# EAGLE schematic MB_Nano_V6s (EAGLE 9.5.0)
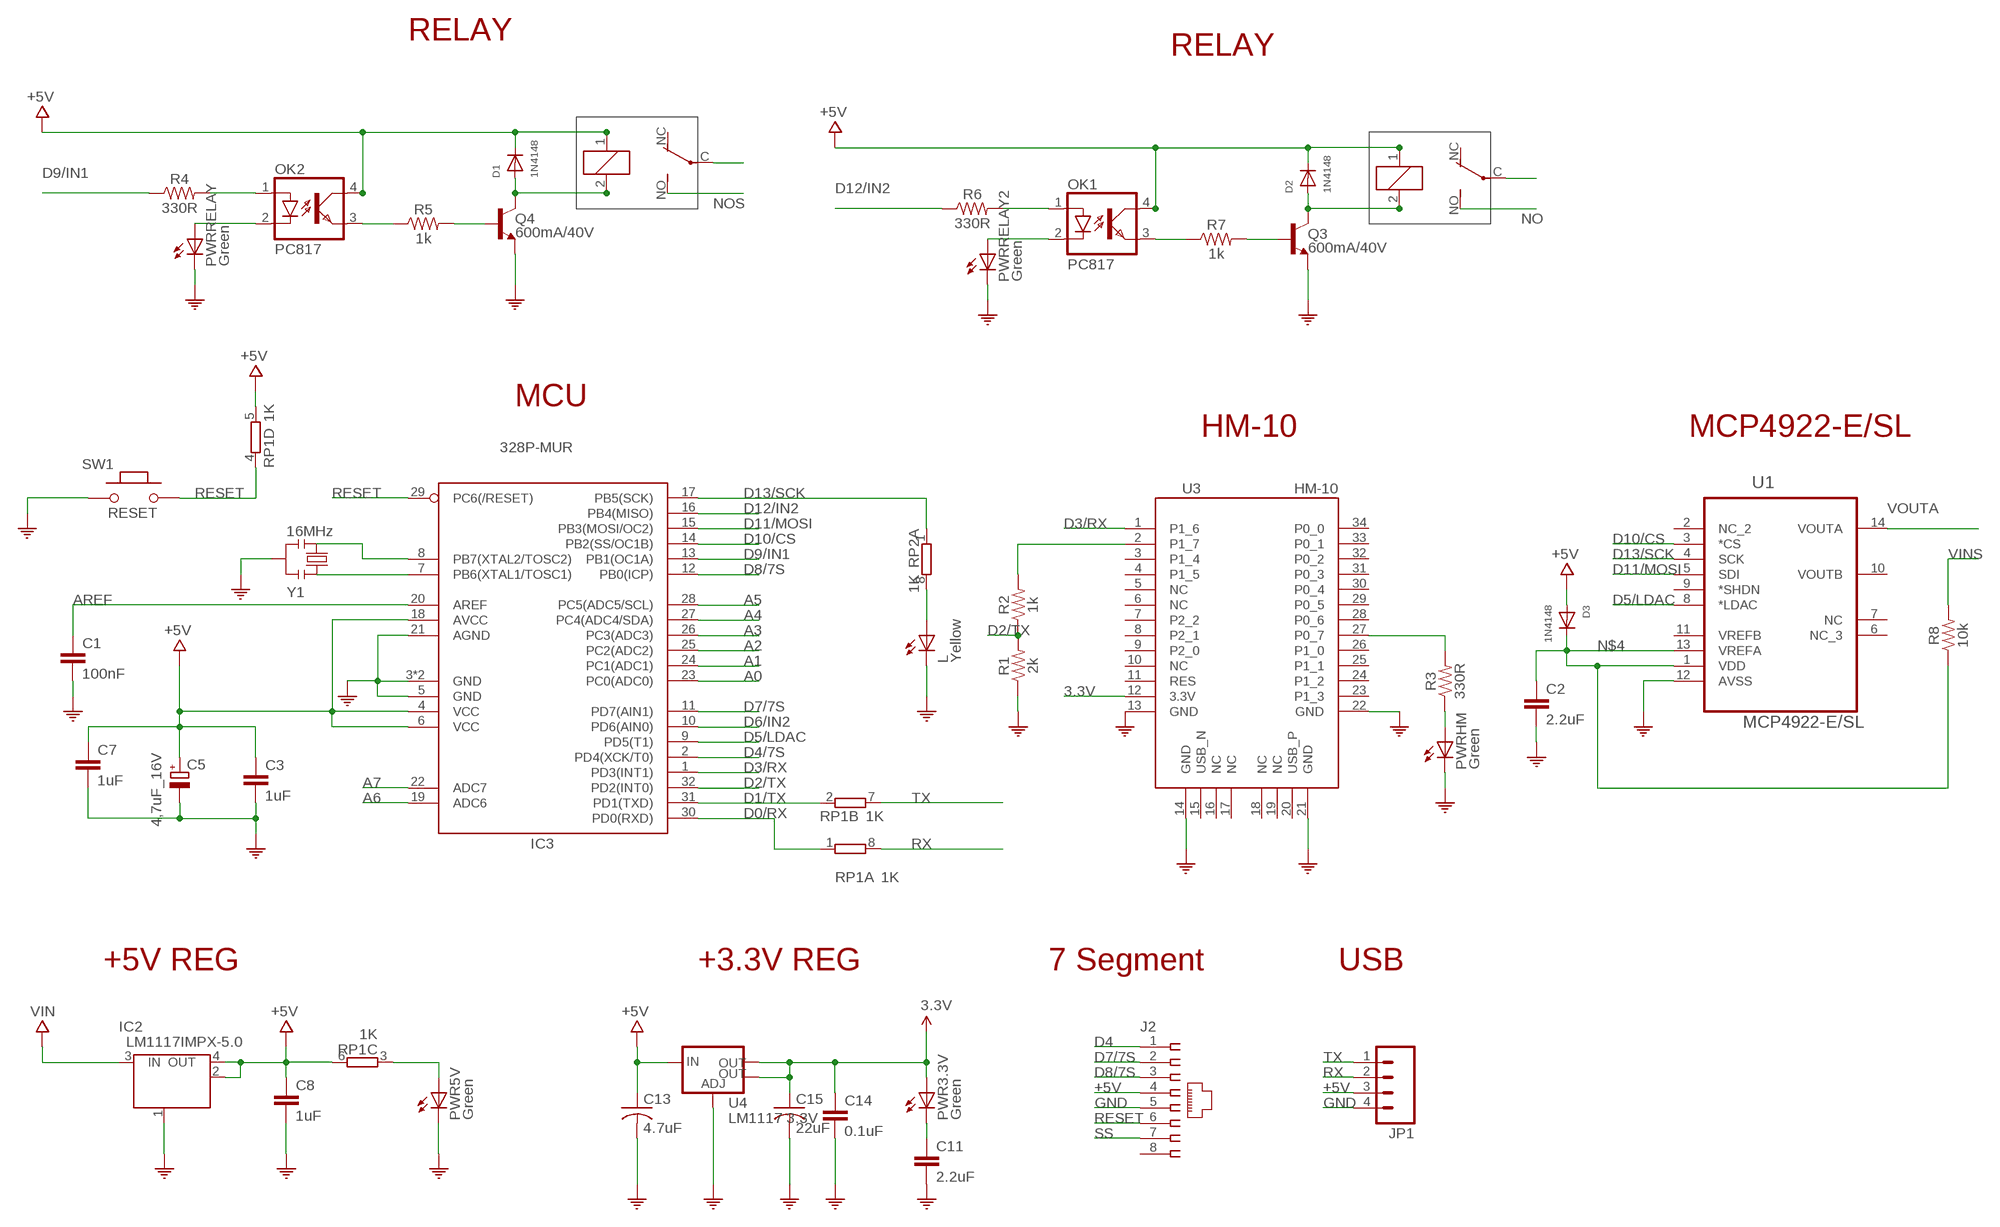
[diagram p0: schematic, sheet 1]

## Parts
C1  100nF  0015_100NF_0603  [C0603-ROUND]
C2  2.2uF  0006_1UF_0603/GRM188R61E105KA12D  [C0603-ROUND]
C3  1uF  0006_1UF_0603/GRM188R61E105KA12D  [C0603-ROUND]
C5  4,7uF_16V  0833_TAJA475MO16RNJ  [TAN-A]
C7  1uF  0006_1UF_0603/GRM188R61E105KA12D  [C0603-ROUND]
C8  1uF  0006_1UF_0603/GRM188R61E105KA12D  [C0603-ROUND]
C11  2.2uF  0006_1UF_0603/GRM188R61E105KA12D  [C0603-ROUND]
C13  4.7uF  C-USC1206  [C1206]
C14  0.1uF  CAP0805  [0805]
C15  22uF  C-USC1206  [C1206]
D1  1N4148  DIODESOD-523  [SOD-523]
D2  1N4148  DIODESOD-523  [SOD-523]
D3  1N4148  DIODESOD-523  [SOD-523]
IC2  LM1117IMPX-5.0  0022_LM1117IMPX-5.0  [LINEAR_SOT223]
IC3  328P-MUR  ATMEGA328P-32MUR  [VQFN32]
J2  520259-4  [520259-4]
JP1  M04POLAR_LOCK  [MOLEX-1X4_LOCK]
L  Yellow  0044_KPT-2012YC  [CHIPLED_0805]
OK1  PC817  [DIL04]
OK2  PC817  [DIL04]
PWR3.3V  Green  0043_KPT-2012SGC  [CHIPLED_0805]
PWR5V  Green  0043_KPT-2012SGC  [CHIPLED_0805]
PWRHM  Green  0043_KPT-2012SGC  [CHIPLED_0805]
PWRRELAY  Green  0043_KPT-2012SGC  [CHIPLED_0805]
PWRRELAY2  Green  0043_KPT-2012SGC  [CHIPLED_0805]
Q3  600mA/40V  TRANS_NPN-MMBT2222AL  [SOT23-3]
Q4  600mA/40V  TRANS_NPN-MMBT2222AL  [SOT23-3]
R1  2k  33OHM-0603-1/10W-1%  [0603]
R2  1k  33OHM-0603-1/10W-1%  [0603]
R3  330R  33OHM-0603-1/10W-1%  [0603]
R4  330R  33OHM-0603-1/10W-1%  [0603]
R5  1k  1KOHM-0603-1/10W-1%  [0603]
R6  330R  33OHM-0603-1/10W-1%  [0603]
R7  1k  1KOHM-0603-1/10W-1%  [0603]
R8  10k  1KOHM-0603-1/10W-1%  [0603]
RELAY5VDC  RELAY 5VDC  CQ1-12V  [CQ1]
RELAY5VDC1  RELAY 5VDC  CQ1-12V  [CQ1]
RP1  1K  0005_064R_1K_/_CAY16-102J4LF  [CAY16]
RP2  1K  0005_064R_1K_/_CAY16-102J4LF  [CAY16]
SW1  RESET  0173_IT-1185AP1C-160G-G_T&R  [SMD_157SW]
U1  MCP4922-E/SL  [SOIC127P600X175-14N]
U3  HM-10  [HM-10]
U4  LM1117 3.3V  V_REG_LM1117SOT223  [SOT223]
Y1  16MHz  0011_CSTCE16M0V53-R0  [RESONATOR]

## Nets
3.3V [power]: C14.1 C15.1 PWR3.3V.A U3.12(3.3V) U4.2(OUT) U4.4(OUT)
3.3V1 [power]: PWRHM.A R3.1
22: D1.A Q4.3(C) RELAY5VDC1.2
+5V: C3.1 C5.1(+) C7.1 C8.1 C13.1 D1.K(C) D2.K(C) D3.A IC2.2(OUT) IC2.4(OUT) IC3.4(VCC) IC3.6(VCC) IC3.18(AVCC) J2.4 JP1.3 OK1.4(COL) OK2.4(COL) RELAY5VDC1.1 RELAY5VDC.1 RP1.5 RP1.6 U4.3(IN)
A0: IC3.23(PC0(ADC0))
A1: IC3.24(PC1(ADC1))
A2: IC3.25(PC2(ADC2))
A3: IC3.26(PC3(ADC3))
A4: IC3.27(PC4(ADC4/SDA))
A5: IC3.28(PC5(ADC5/SCL))
A6: IC3.19(ADC6)
A7: IC3.22(ADC7)
AREF: C1.1 IC3.20(AREF)
COM: C1.2 C2.2 C3.2 C5.2(-) C7.2 C8.2 C11.2 C13.2 C14.2 C15.2 IC2.1(GND/ADJ) IC3.3(GND) IC3.5(GND) IC3.21(AGND) IC3.33(GND) L.C PWR5V.C PWRHM.C PWRRELAY2.C PWRRELAY.C Q3.2(E) Q4.2(E) R1.1 SW1.1 U1.12(AVSS) U3.13(GND) U3.14(GND) U3.21(GND) U3.22(GND) U4.1(ADJ) Y1.2
D0/RX: IC3.30(PD0(RXD)) RP1.1
D1/TX: IC3.31(PD1(TXD)) RP1.2
D2/TX: IC3.32(PD2(INT0)) R1.2 R2.1
D3/RX: IC3.1(PD3(INT1)) U3.1(P1_6)
D4: J2.1
D4/7S: IC3.2(PD4(XCK/T0))
D5/LDAC: IC3.9(PD5(T1)) U1.8(*LDAC)
D6/IN2: IC3.10(PD6(AIN0))
D7/7S: IC3.11(PD7(AIN1)) J2.2
D8/7S: IC3.12(PB0(ICP)) J2.3
D9/IN1: IC3.13(PB1(OC1A)) R4.1
D10/CS: IC3.14(PB2(SS/OC1B)) U1.3(*CS)
D11/MOSI: IC3.15(PB3(MOSI/OC2)) U1.5(SDI)
D12/IN2: IC3.16(PB4(MISO)) R6.1
D13/SCK: IC3.17(PB5(SCK)) RP2.1 U1.4(SCK)
GND: J2.5 JP1.4
GND-: D2.A Q3.3(C) RELAY5VDC.2
INS: OK1.1(A) R6.2
INSS: OK2.1(A) R4.2
LED: OK1.2(C) PWRRELAY2.A
LEDS: OK2.2(C) PWRRELAY.A
N$1: IC3.8(PB7(XTAL2/TOSC2)) Y1.3
N$2: IC3.7(PB6(XTAL1/TOSC1)) Y1.1
N$3: PWR5V.A RP1.3
N$4 [power]: C2.1 C11.1 D3.K(C) PWR3.3V.C R8.1 U1.1(VDD) U1.13(VREFA)
N$5: R3.2 U3.27(P0_7)
N$7: L.A RP2.8
N$8: R2.2 U3.2(P1_7)
N$12: Q3.1(B) R7.2
N$20: Q4.1(B) R5.2
N$22: OK2.3(EMIT) R5.1
NO: RELAY5VDC.NO(2:S)
NOS: RELAY5VDC1.NO(2:S)
OTP: OK1.3(EMIT) R7.1
RESET: IC3.29(PC6(/RESET)) J2.6 RP1.4 SW1.2
RGND: RELAY5VDC.C(2:P)
RGNDS: RELAY5VDC1.C(2:P)
RX: JP1.2 RP1.8
SS: J2.7
TX: JP1.1 RP1.7
VIN: IC2.3(IN)
VINS: R8.2
VOUTA: U1.14(VOUTA)
Unconnected: J2.8 RELAY5VDC1.NC(2:O) RELAY5VDC.NC(2:O) RP2.2 RP2.3 RP2.4 RP2.5 RP2.6 RP2.7 U1.2(NC_2) U1.6(NC_3) U1.7(NC) U1.9(*SHDN) U1.10(VOUTB) U1.11(VREFB) U3.3(P1_4) U3.4(P1_5) U3.5(NC) U3.6(NC) U3.7(P2_2) U3.8(P2_1) U3.9(P2_0) U3.10(NC) U3.11(RES) U3.15(USB_N) U3.16(NC) U3.17(NC) U3.18(NC) U3.19(NC) U3.20(USB_P) U3.23(P1_3) U3.24(P1_2) U3.25(P1_1) U3.26(P1_0) U3.28(P0_6) U3.29(P0_5) U3.30(P0_4) U3.31(P0_3) U3.32(P0_2) U3.33(P0_1) U3.34(P0_0)

## Notes on the sheet
- RELAY
- RELAY
- MCU
- HM-10 | MCP4922-E/SL
- +5V REG | +3.3V REG | 7 Segment | USB

## Library data of the parts
C1 = Condensatori:0015_100NF_0603: 100nF 0603 50V; CASE: 0603; MONTHLY_USAGE: _____; PART_NUMBER: cl10b104kbnc; PRICE: _____; SUPPLIER: _____; TYPE: Condensatori
C2 C11 = Condensatori:0006_1UF_0603/GRM188R61E105KA12D: 1uF 0603; CASE: 0603; MONTHLY_USAGE: _____; PART_NUMBER: 1uF_0603/GRM188R61E105KA12D; PRICE: _____; SUPPLIER: _____; TYPE: Condensatori; VALUE: 1uF
C3 C7 C8 = Condensatori:0006_1UF_0603/GRM188R61E105KA12D: 1uF 0603; CASE: 0603; MONTHLY_USAGE: _____; PART_NUMBER: 1uF_0603/GRM188R61E105KA12D; PRICE: _____; SUPPLIER: _____; TYPE: Condensatori
C5 = Condensatori:0833_TAJA475MO16RNJ: 4,7uF; CASE: Case_A_(1206); MONTHLY_USAGE: _____; PART_NUMBER: TAJA475MO16RNJ; PRICE: _____; SUPPLIER: _____; TYPE: Condensatori
C13 C15 = adafruit:C-US: CAPACITOR, American symbol
C14 = SparkFun-Passives:CAP: Capacitor Standard 0603 ceramic capacitor, and 0.1" leaded capacitor.
D1-D3 = adafruit:DIODE: Diode SMADIODE - SMA Surface Mount Package 20V 1A Schottky Diode Digikey: 641-1014-6-ND DO-1N4148 - Through Hole Small Current Diode SOD-123 20V 1 A (.5mV Vf) Schottky Diode - Digikey: MBRX120TPMSCT-ND SOD-323 10V 570mA (.38mV Vf, 3ns) Schottky Diode - Digikey: ZLLS410CT-ND SOD-523 30V 30mA Schottky Diode (RB751S-40TE61) - Digikey: RB751S-40TE61CT-ND SOT23-R/W - SOT23 Package (R = Solder Paste/Reflow Ovens, W = Hand-Soldering) BAT54Film 40V 300mA - Digikey: 497-7162-1-ND
IC2 = IntegratedCircuits:0022_LM1117IMPX-5.0: Low-dropout linear regulator 5V -LM1117IMPX-5.0; CASE: SOT223; MONTHLY_USAGE: _____; PART_NUMBER: LM1117IMPX-5.0; PRICE: _____; SUPPLIER: _____; TYPE: Circuito_Integrato
IC3 = Arduino-ucs&SoCs:ATMEGA328P-32: 8-bit Microcontroller with 32KBytes In-System Programmable Flash ATMEGA328P-AU; DATASHEET: http://www.atmel.com/images/Atmel-8271-8-bit-AVR-Microcontroller-ATmega48A-48PA-88A-88PA-168A-168PA-328-328P_datasheet_Complete.pdf; DISTRIBUTOR-LINK: https://www.digikey.it/product-detail/it/microchip-technology/ATMEGA328P-MUR/ATMEGA328P-MURCT-ND/3440953; DISTRIBUTOR-PN: ATMEGA328P-MURCT-ND; MANUFACTURER: ATMEL; MANUFACTURER-PN: ATMEGA328P-MUR
J2 = con-amp:520259-4: AMP connector
JP1 = SparkFun-Connectors:M04: Header 4 Standard 4-pin 0.1" header. Use with straight break away headers (SKU : PRT-00116), right angle break away headers (PRT-00553), swiss pins (PRT-00743), machine pins (PRT-00117), and female headers (PRT-00115). Molex polarized connector foot print use with SKU : PRT-08231 with associated crimp pins and housings. 1MM SMD Version SKU: PRT-10208
L = Opto:0044_KPT-2012YC: LED YELLOW - SMD - 0805; MONTHLY_USAGE: _____; PART_NUMBER: KPT-2012YC; PRICE: _____; SUPPLIER: _____; TYPE: Opto
OK1 OK2 = optocoupler:PC817: SHARP OPTO COUPLER; MPN: PC817X4J000F; OC_FARNELL: 9707727; OC_NEWARK: 97K7059
PWR3.3V PWR5V PWRHM PWRRELAY PWRRELAY2 = Opto:0043_KPT-2012SGC: LED GREEN - SMD-0805; MONTHLY_USAGE: _____; PART_NUMBER: KPT-2012SGC; PRICE: _____; SUPPLIER: _____; TYPE: Opto
Q3 Q4 = SparkFun-DiscreteSemi:TRANS_NPN: NPN transistor Current controlled devices typically used to amplify current or used as a switch. BC547 - COM-08928 <http://www.sparkfun.com/products/8928> (TO-92 45V 100mA) (1.Collector 2.Base 3.Emitter) 2N3904 - COM-00521 <http://www.sparkfun.com/products/521> (TO-92 40V 200mA) (1.Emitter 2.Base 3.Collector) P2N2222A - COM-12852 <http://www.sparkfun.com/products/12852> (TO-92 40V 600mA) (1.Collector 2.Base 3.Emitter); PROD_ID: TRANS-08049
R1-R4 R6 = SparkFun-Resistors:33OHM: 33Ω resistor A resistor is a passive two-terminal electrical component that implements electrical resistance as a circuit element. Resistors act to reduce current flow, and, at the same time, act to lower voltage levels within circuits. - Wikipedia; PROD_ID: RES-08270; VALUE: 33
R5 R7 = SparkFun-Resistors:1KOHM: 1kΩ resistor A resistor is a passive two-terminal electrical component that implements electrical resistance as a circuit element. Resistors act to reduce current flow, and, at the same time, act to lower voltage levels within circuits. - Wikipedia; PROD_ID: RES-07856
R8 = SparkFun-Resistors:1KOHM: 1kΩ resistor A resistor is a passive two-terminal electrical component that implements electrical resistance as a circuit element. Resistors act to reduce current flow, and, at the same time, act to lower voltage levels within circuits. - Wikipedia; PROD_ID: RES-07856; VALUE: 1k
RELAY5VDC RELAY5VDC1 = relay:CQ1-12V: AUTOMOTIVE QUIET RELAY NAiS Source: http://www.mew-europe.com/.. en_ds_61208_0000.pdf; OC_FARNELL: unknown; OC_NEWARK: unknown
RP1 RP2 = Resistenze:0005_064R_1K_/_CAY16-102J4LF: 1K 064R; CASE: SMD_3,2x1,6; MONTHLY_USAGE: _____; PART_NUMBER: 064R_1K_/_CAY16-102J4LF; PRICE: _____; SUPPLIER: _____; TYPE: Resistenze
SW1 = Switches:0173_IT-1185AP1C-160G-G_T&R: Pushbutton 4x3 SMD H2,5mm; MONTHLY_USAGE: _____; PART_NUMBER: IT-1185AP1C-160G-G_T&R; PRICE: _____; SUPPLIER: _____; TYPE: Switches; VALUE: 157SW
U1 = Microchip_By_element14_Batch_1:MCP4922-E/SL: IC, 12BIT DAC DUAL, SPI I/F; MPN: MCP4922-E/SL; OC_FARNELL: 1332114; OC_NEWARK: 08J8748; PACKAGE: SOIC14; SUPPLIER: Microchip
U3 = HM-10_BLE:HM-10
U4 = SparkFun-PowerIC:V_REG_LM1117: Voltage Regulator LM1117 Standard adjustable voltage regulator but in SMD form. Spark Fun Electronics SKU : COM-00595; PROD_ID: VREG-08170
Y1 = Cristalli:0011_CSTCE16M0V53-R0: 16Mhz - SMD; MONTHLY_USAGE: _____; PART_NUMBER: CSTCE16M0V53-R0; PRICE: _____; SUPPLIER: _____; TYPE: Cristalli; VALUE: CSTCE16M0V53-R0

## Net classes
1 power: width 0.254 mm, drill 0.33 mm, clearance 0.152 mm